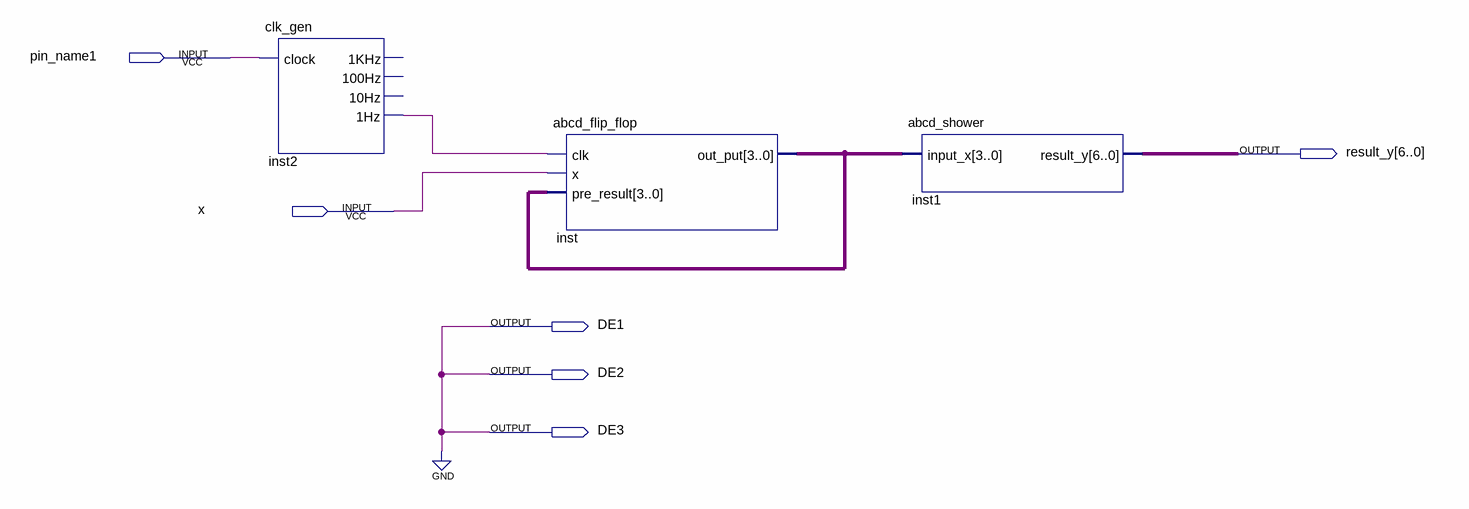
[diagram p0: schematic sheet]
// Quartus schematic abcd_inreal.bdf as structural Verilog: 3 symbols, 6 pins
module abcd_inreal (
  input  pin_name1,
  input  x,
  output [6:0] result_y,
  output DE1,
  output DE2,
  output DE3
);

  wire inst2_1hz;
  wire [3:0] inst_out_put;

  clk_gen inst2 (.clock(pin_name1), .\1Hz (inst2_1hz));  // open: 1KHz, 100Hz, 10Hz
  abcd_flip_flop inst (.clk(inst2_1hz), .x(x), .pre_result(inst_out_put), .out_put(inst_out_put));
  abcd_shower inst1 (.input_x(inst_out_put), .result_y(result_y));

  assign DE1 = 1'b0;
  assign DE2 = 1'b0;
  assign DE3 = 1'b0;
endmodule
